# Altium schematic sheet REMO_4OUT.SchDoc
size A
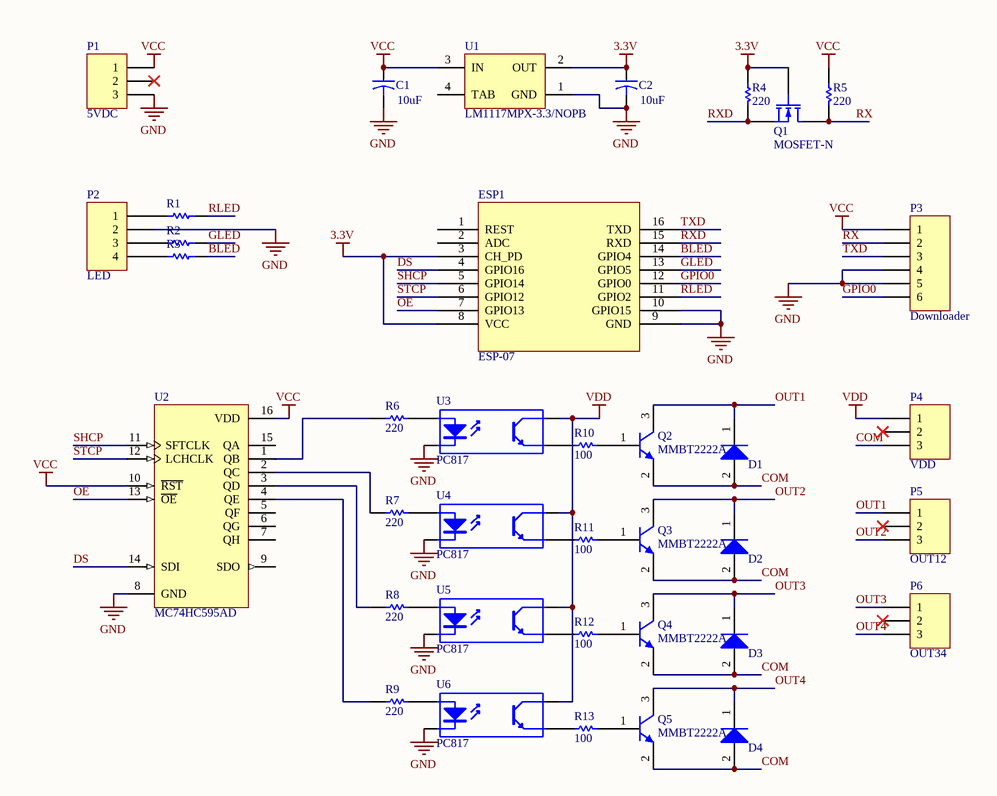
[diagram p0: REMO_4OUT.SchDoc]

## Parts
C1  value 10uF  [6-0805_L]  (hidden comment: Cap2)
C2  value 10uF  [6-0805_L]  (hidden comment: Cap2)
D1  MMSD4148T3G  [ONSC-SOD-123-2-425-04_V]  (value not drawn)
D2  MMSD4148T3G  [ONSC-SOD-123-2-425-04_V]  (value not drawn)
D3  MMSD4148T3G  [ONSC-SOD-123-2-425-04_V]  (value not drawn)
D4  MMSD4148T3G  [ONSC-SOD-123-2-425-04_V]  (value not drawn)
ESP1  ESP-07  [ESP-07]
P1  5VDC  [HDR1X3]
P2  LED  [HDR1X4]
P3  Downloader  [HDR1X6]
P4  VDD  [HDR1X3]
P5  OUT12  [HDR1X3]
P6  OUT34  [HDR1X3]
Q1  MOSFET-N  [SOT23_N]
Q2  MMBT2222A  [INF-SOT23_N]
Q3  MMBT2222A  [INF-SOT23_N]
Q4  MMBT2222A  [INF-SOT23_N]
Q5  MMBT2222A  [INF-SOT23_N]
R1  Res1  [AXIAL-0.3]  (value not drawn)
R2  Res1  [AXIAL-0.3]  (value not drawn)
R3  Res1  [AXIAL-0.3]  (value not drawn)
R4  220  [6-0805_N]
R5  220  [6-0805_N]
R6  220  [6-0805_N]
R7  220  [6-0805_N]
R8  220  [6-0805_N]
R9  220  [6-0805_N]
R10  100  [6-0805_N]
R11  100  [6-0805_N]
R12  100  [6-0805_N]
R13  100  [6-0805_N]
U1  LM1117MPX-3.3/NOPB  [MP04A_N]
U2  MC74HC595AD  [751B-05_N]
U3  PC817  [DIP-4]
U4  PC817  [DIP-4]
U5  PC817  [DIP-4]
U6  PC817  [DIP-4]

## Nets
3.3V: C2.1 ESP1.3(CH_PD) ESP1.8(VCC) Q1.2(G) R4.1 U1.2(OUT)
GND: C1.2 C2.2 ESP1.9(GND) ESP1.10(GPIO15) P1.3 P2.2 P3.4 P3.5 U1.1(GND) U2.8(GND) U3.2(K) U4.2(K) U5.2(K) U6.2(K)
VCC: C1.1 P1.1 P3.1 R5.1 U1.3(IN) U2.10(~{RST}) U2.16(VDD)
VDD: P4.1 U3.4(C) U4.4(C) U5.4(C) U6.4(C)
BLED: ESP1.14(GPIO4) R3.2
COM: D1.2(A) D2.2(A) D3.2(A) D4.2(A) P4.3 Q2.2(E) Q3.2(E) Q4.2(E) Q5.2(E)
DS: ESP1.4(GPIO16) U2.14(SDI)
GLED: ESP1.13(GPIO5) R2.2
GPIO0: ESP1.12(GPIO0) P3.6
OE: ESP1.7(GPIO13) U2.13(~{OE})
OUT1: D1.1(K) P5.1 Q2.3(C)
OUT2: D2.1(K) P5.3 Q3.3(C)
OUT3: D3.1(K) P6.1 Q4.3(C)
OUT4: D4.1(K) P6.3 Q5.3(C)
RLED: ESP1.11(GPIO2) R1.2
RX: P3.2 Q1.1(D) R5.2
RXD: ESP1.15(RXD) Q1.3(S) R4.2
SHCP: ESP1.5(GPIO14) U2.11(SFTCLK)
STCP: ESP1.6(GPIO12) U2.12(LCHCLK)
TXD: ESP1.16(TXD) P3.3
NetP2_1: P2.1 R1.1
NetP2_3: P2.3 R2.1
NetP2_4: P2.4 R3.1
NetQ2_1: Q2.1(B) R10.2
NetQ3_1: Q3.1(B) R11.2
NetQ4_1: Q4.1(B) R12.2
NetQ5_1: Q5.1(B) R13.2
NetR6_1: R6.1 U2.1(QB)
NetR6_2: R6.2 U3.1(A)
NetR7_1: R7.1 U2.2(QC)
NetR7_2: R7.2 U4.1(A)
NetR8_1: R8.1 U2.3(QD)
NetR8_2: R8.2 U5.1(A)
NetR9_1: R9.1 U2.4(QE)
NetR9_2: R9.2 U6.1(A)
NetR10_1: R10.1 U3.3(E)
NetR11_1: R11.1 U4.3(E)
NetR12_1: R12.1 U5.3(E)
NetR13_1: R13.1 U6.3(E)

Not connected (* = marked no-connect by the designer): ESP1 1(REST) 2(ADC); P1 2*; P4 2*; P5 2*; P6 2*; U1 4(TAB); U2 5(QF) 6(QG) 7(QH) 9(SDO) 15(QA)

## Library data of the parts
C1 C2 = Cap2: Capacitor; Published: 23-Sep-2002; PackageReference: CAPR5-4X5; Publisher: Altium Limited
D1-D4 = MMSD4148T3G: Switching Diode, 2-Pin SOD-123, Pb-Free, Tape and Reel; Manufacturer: On Semiconductor; Configuration: Single; IF Max (A): 0.2; trr Max (ns): 4; DatasheetVersion: Rev. 11; PackageVersion: Rev. G, 10/2009; PackageReference: SOD-123-2-425-04; PackageDescription: 2-Pin SOD, Body 1.6 x 2.69 mm; Supplier 1: Digi-Key; Supplier Part Number 1: MMSD4148T3GOSTR-ND; Supplier 2: Digi-Key; Supplier Part Number 2: MMSD4148T3GOSCT-ND; Supplier 3: Digi-Key; Supplier Part Number 3: MMSD4148T3GOSDKR-ND; Supplier 4: Farnell; Supplier Part Number 4: 2368409; Supplier 5: Newark; Supplier Part Number 5: 10N9495; Supplier 6: Newark; Supplier Part Number 6: 02M9801; Supplier 7: Mouser; Supplier Part Number 7: 863-MMSD4148T3G; Packing: Tape and Reel; RoHS: TRUE; Mounting Technology: Surface Mount; PartNumber: MMSD4148T3G; ComponentLink1Description: Manufacturer URL; ComponentLink1URL: http://www.onsemi.com/; ComponentLink2Description: Datasheet; ComponentLink2URL: http://www.onsemi.com/pub_link/Collateral/MMSD4148T1-D.PDF; ComponentLink3Description: Package Specification; ComponentLink3URL: http://www.onsemi.com/pub_link/Collateral/425-04.PDF
P1 P4-P6 = Header 3: Header, 3-Pin; LatestRevisionDate: 17-Jul-2002; LatestRevisionNote: Re-released for DXP Platform.; Publisher: Altium Limited
P2 = Header 4: Header, 4-Pin; LatestRevisionDate: 17-Jul-2002; LatestRevisionNote: Re-released for DXP Platform.; Publisher: Altium Limited
P3 = Header 6: Header, 6-Pin; LatestRevisionDate: 17-Jul-2002; LatestRevisionNote: Re-released for DXP Platform.; Publisher: Altium Limited
Q1 = MOSFET-N: N-Channel MOSFET; pin to pad: 2>3 3>2; PackageDocument: 1995/1996; Published: 8-Jun-2000; LatestRevisionDate: 17-Jul-2002; LatestRevisionNote: Re-released for DXP Platform.; PackageReference: E3; Publisher: Altium Limited
Q2-Q5 = MMBT2222A: NPN Silicon Switching Transistor, 40 V VCEO, 600 mA IC, SOT23, Reel, Green; Manufacturer: Infineon; Green: TRUE; IC: 150 mA; IC (max): 600 mA; ICBO (max): 10 nA; VCBO (max): 75 V; VCE: 10 V; VCEO (max): 40 V; VEBO (max): 6 V; PackageVersion: Apr-08; PackageReference: SOT23; PackageDescription: 3-Pin Small Outline Transistor Package, 1.3 x 2.9 mm Body, 0.95 mm Pitch; Packing: Reel; Polarity: NPN; VCE (max): 10 V; Mounting Technology: Surface Mount; PartNumber: MMBT2222A; ComponentLink1Description: Manufacturer URL; ComponentLink1URL: http://www.infineon.com/; ComponentLink2Description: Datasheet; ComponentLink2URL: http://www.infineon.com/dgdl/smbt2222a_mmbt2222a.pdf?folderId=db3a30431441fb5d011445fab851018e&fileId=db3a30431441fb5d011445fbaff0018f; ComponentLink3Description: Package Specification; ComponentLink3URL: http://www.infineon.com/dgdl/SOT23-Package_Overview.pdf?folderId=db3a30431936bc4b0119532290053c66&fileId=db3a30431936bc4b0119533468123c85
R1-R3 = Res1: Resistor; Value: 1K; Published: 8-Jun-2000; LatestRevisionDate: 17-Jul-2002; LatestRevisionNote: Re-released for DXP Platform.; PackageReference: AXIAL-0.3; Publisher: Altium Limited; PackageDescription: Axial Device, Thru-Hole; 2 Leads; 0.3 in Pin Spacing
R4-R13 = RES0805
U1 = LM1117MPX-3.3/NOPB: 800mA Low-Dropout Linear Regulator, 4-pin SOT-223, Pb-Free; Manufacturer: National Semiconductor; PackageTopMarking: XYTT*N05A; PowerWise: N; CompType: LDO IC; High-Reliability: Y; DatasheetVersion: Apr-2006; PackageVersion: revB, Apr-2003; PackageReference: MP04A; PackageDescription: Molded SOT-223, 6.50 x 3.56 x 1.6mm Body, 4 Lead, 2.3mm Pitch; PartNumber: LM1117MPX-3.3/NOPB; RoHS: Y; PinCount: 4; Code_JEDEC: TO-261-AA; Code_IPC: SOT223-4; ComponentLink1Description: Manufacturer URL; ComponentLink1URL: http://www.national.com/; ComponentLink2Description: LM1117 Datasheet; ComponentLink2URL: http://www.national.com/ds/LM/LM1117.pdf; ComponentLink3Description: LM1117 Web Page; ComponentLink3URL: http://www.national.com/pf/LM/LM1117.html; ComponentLink4Description: MP04A Package Page; ComponentLink4URL: http://www.national.com/packaging/folders/mp04a.html
U2 = MC74HC595AD: 8-Bit Serial-Input/Serial or Prallel-Output Shift Register with Latched 3-State Outputs; Published: 15-Apr-2002; LatestRevisionDate: 13-Apr-2006; LatestRevisionNote: IPC-7351 Footprint Added.; DatasheetVersion: Mar-2000; PackageVersion: Oct-1999; PackageReference: 751B-05; Publisher: Altium Limited; PackageDescription: 16-Pin Small Outline Integrated Circuit 1.27 mm Pitch; Code_JEDEC: MS-012-AC; Code_IPC: SOIC127P600-16; ComponentLink1Description: Manufacturer Link; ComponentLink1URL: http://www.onsemi.com/; ComponentLink2Description: Datasheet; ComponentLink2URL: http://www.onsemi.com/pub/Collateral/MC74HC595A-D.PDF
U3-U6 = Optoisolator1: 4-Pin Phototransistor Optocoupler; Published: 24-Mar-1999; LatestRevisionDate: 04-Mar-2005; LatestRevisionNote: Sch pins 3 & 4 Swapped.; DatasheetVersion: Nov-2003; PackageReference: DIP-4; Publisher: Altium Limited